# Altium project XH发衣柜从板.PrjPcb
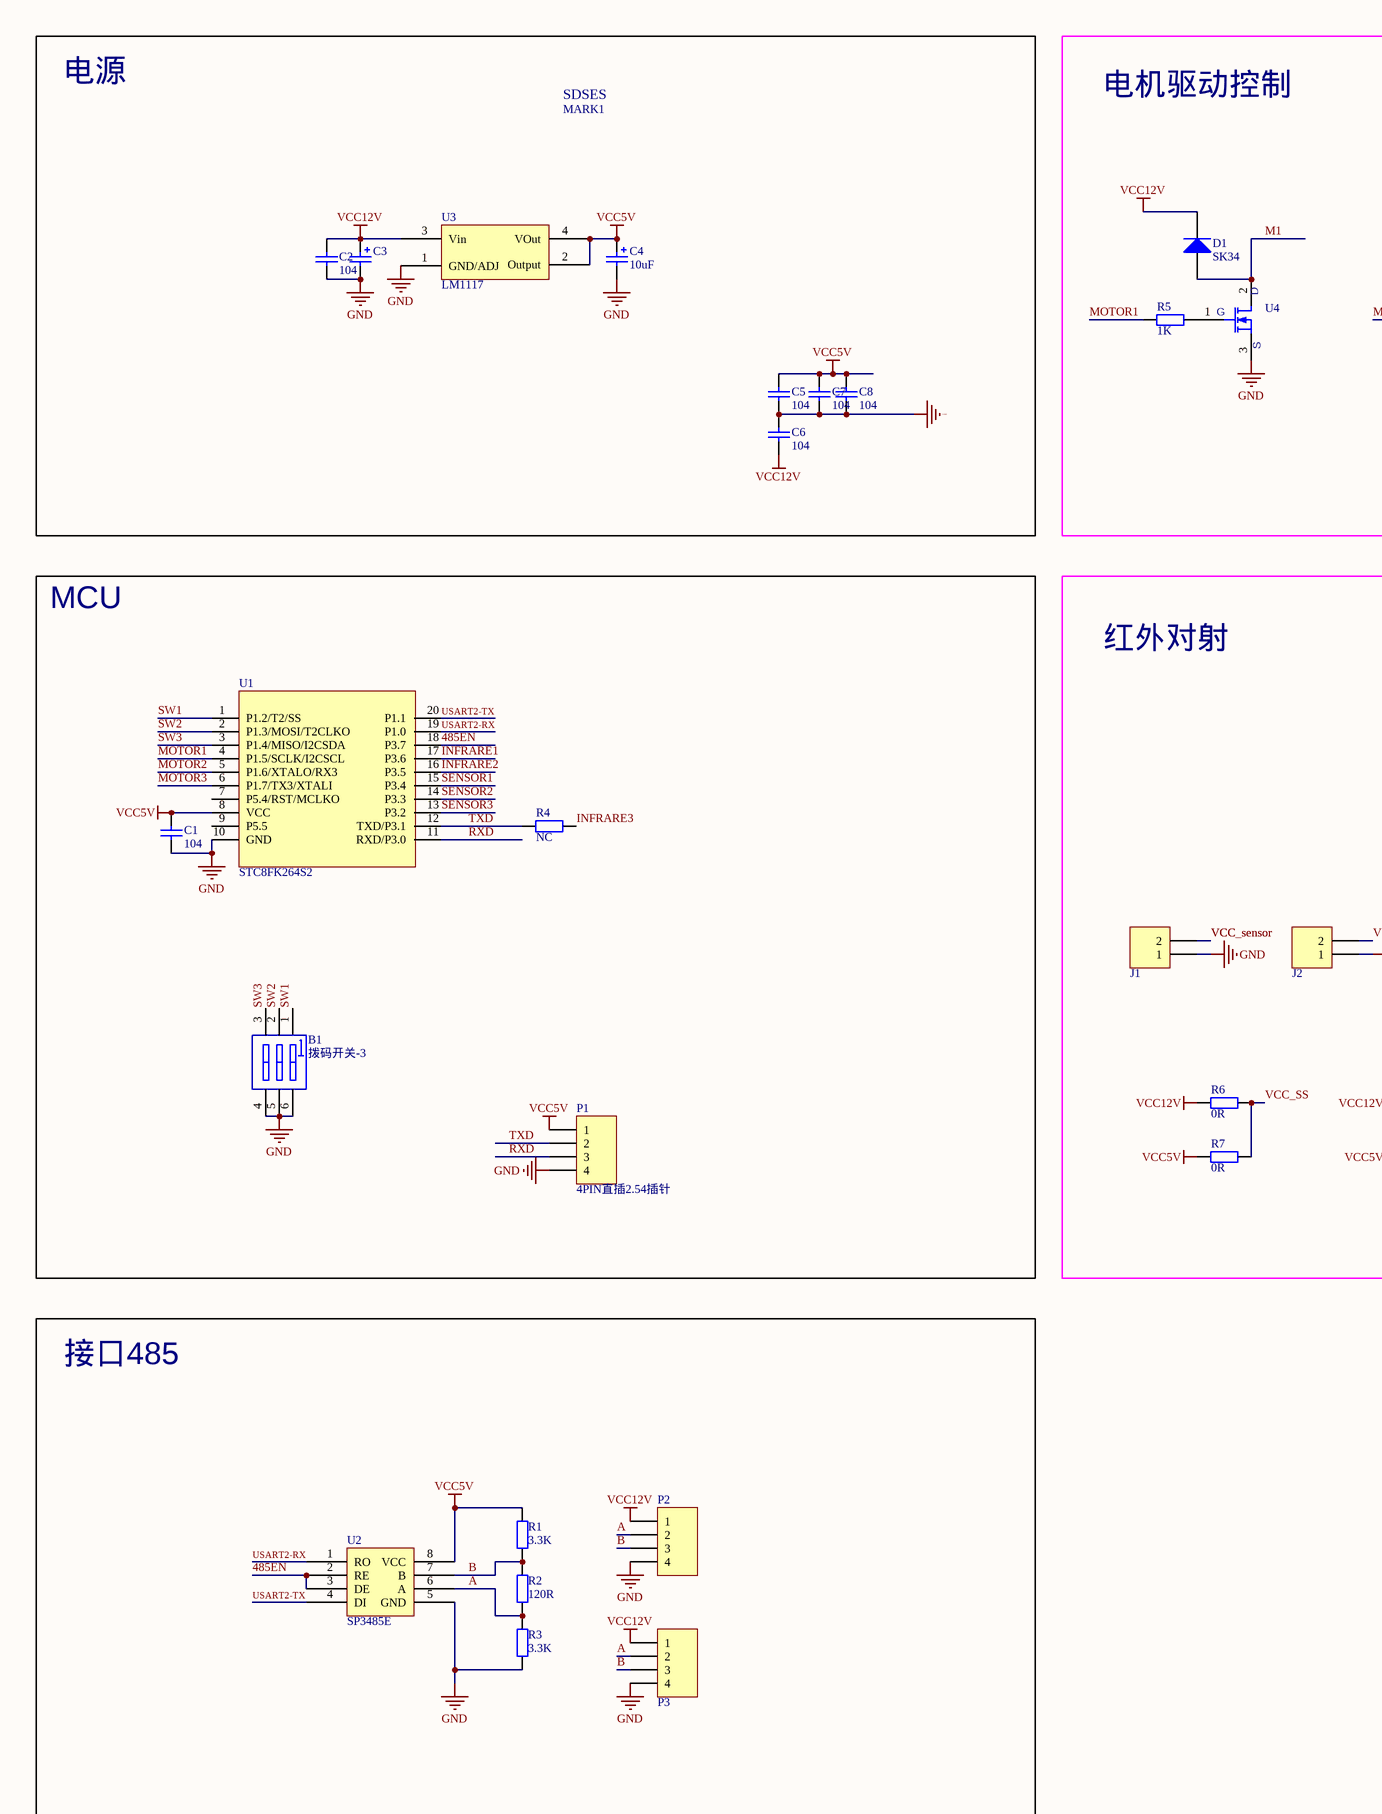
[diagram p0: MAIN.SchDoc, left]
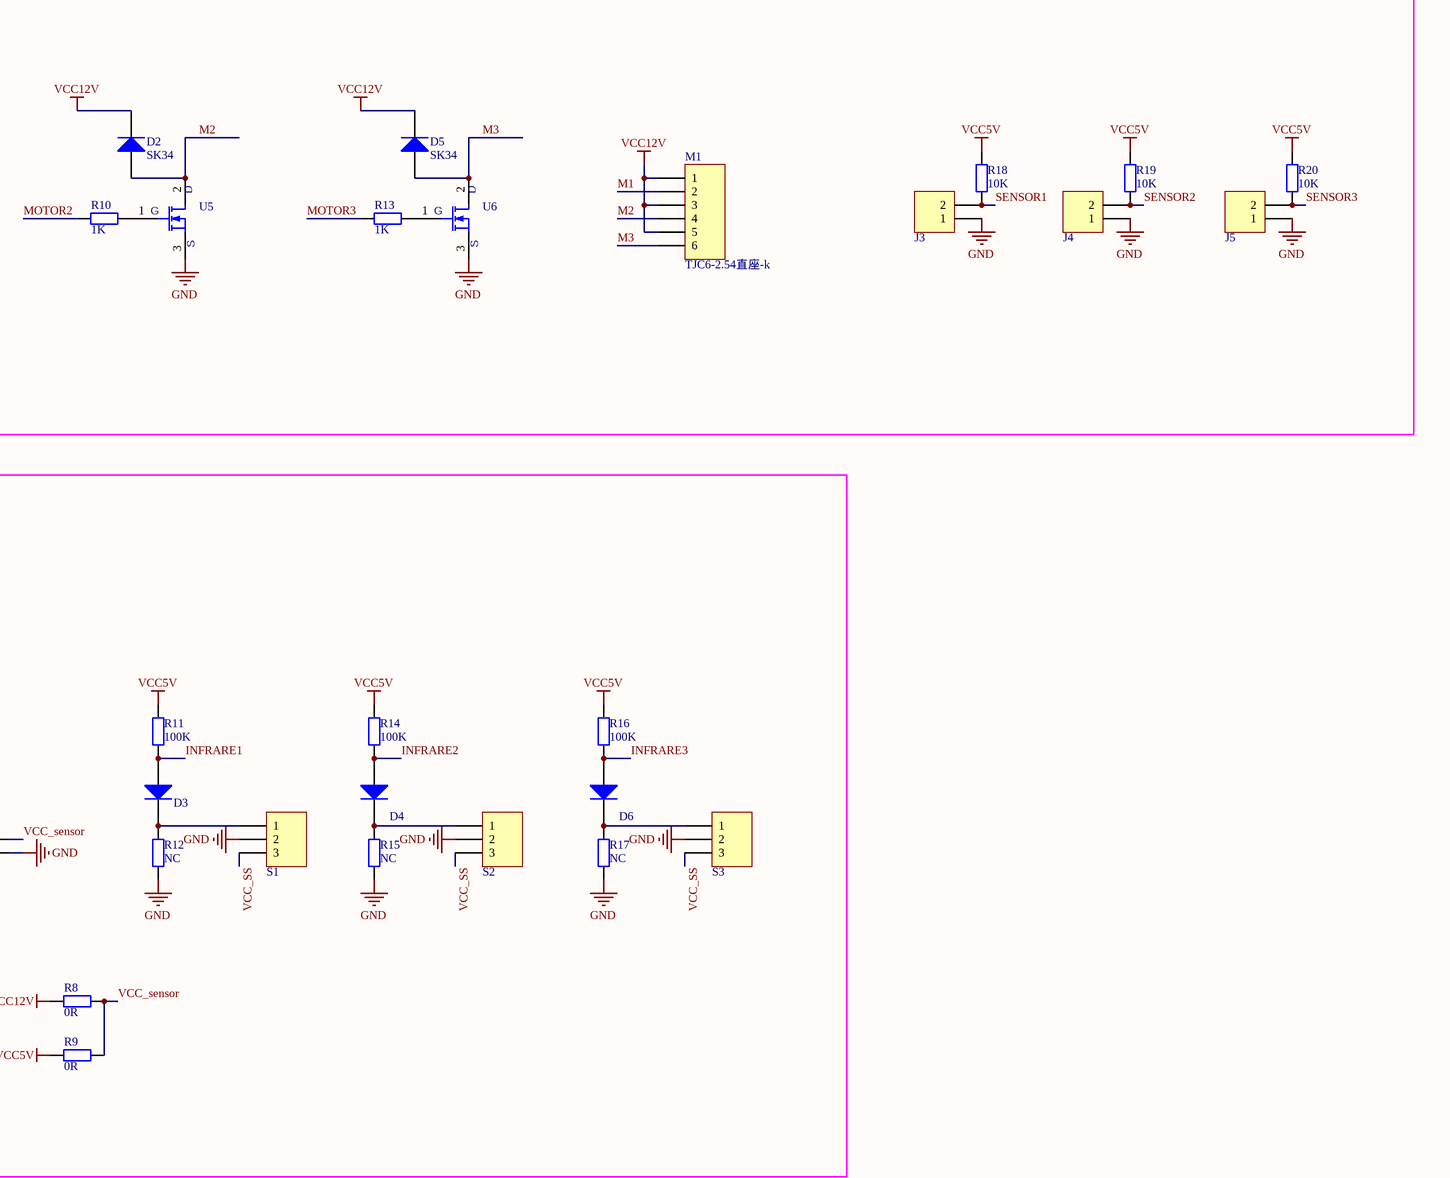
[diagram p1: MAIN.SchDoc, right]
1 sheet, 54 parts. Net scope: global (net labels, ports and power ports of the same name join across sheets).
Board file: XH发衣柜从板.PcbDoc

## Sheet MAIN.SchDoc
size A2

### Parts
B1  拨码开关-3  [DS-03-2.54]
C1  型号: 104  [0603C]  (hidden comment: Cap_0603)
C2  型号: 104  [0603C]  (hidden comment: Cap_0603)
C3  Cap_直插470uf/16v  [cap_470/16v]  (value not drawn)
C4  型号: 10uF  [0805C]  (hidden comment: Cap_钽电容B-3528)
C5  型号: 104  [0603C]  (hidden comment: Cap_0603)
C6  型号: 104  [0603C]  (hidden comment: Cap_0603)
C7  型号: 104  [0603C]  (hidden comment: Cap_0603)
C8  型号: 104  [0603C]  (hidden comment: Cap_0603)
D1  型号: SK34  [DO_214AC_SMA]  (hidden comment: Diode_DO214AC)
D2  型号: SK34  [DO_214AC_SMA]  (hidden comment: Diode_DO214AC)
D3  Diode_SOD323  [SOD323_D]  (value not drawn)
D4  Diode_SOD323  [SOD323_D]  (value not drawn)
D5  型号: SK34  [DO_214AC_SMA]  (hidden comment: Diode_DO214AC)
D6  Diode_SOD323  [SOD323_D]  (value not drawn)
J1  XHB2.54-2PIN-带锁扣  [SIP2]  (value not drawn)
J2  XHB2.54-2PIN-带锁扣  [SIP2]  (value not drawn)
J3  XHB2.54-2PIN-带锁扣  [SIP2]  (value not drawn)
J4  XHB2.54-2PIN-带锁扣  [SIP2]  (value not drawn)
J5  XHB2.54-2PIN-带锁扣  [SIP2]  (value not drawn)
M1  TJC6-2.54直座-k  [SIP6]
MARK1  SDSES  [SDSES]  (value not drawn)
P1  4PIN直插2.54插针  [SIP4_2D54F]
P2  XHB2.54-4PIN直座  [SIP4]  (value not drawn)
P3  XHB2.54-4PIN直座  [SIP4]  (value not drawn)
R1  型号: 3.3K  [0603R]  (hidden comment: Res_0603)
R2  型号: 120R  [0603R]  (hidden comment: Res_0603)
R3  型号: 3.3K  [0603R]  (hidden comment: Res_0603)
R4  型号: NC  [0603R]  (hidden comment: Res_0603)
R5  型号: 1K  [0603R]  (hidden comment: Res_0603)
R6  型号: 0R  [0603R]  (hidden comment: Res_0603)
R7  型号: 0R  [0603R]  (hidden comment: Res_0603)
R8  型号: 0R  [0603R]  (hidden comment: Res_0603)
R9  型号: 0R  [0603R]  (hidden comment: Res_0603)
R10  型号: 1K  [0603R]  (hidden comment: Res_0603)
R11  型号: 100K  [0603R]  (hidden comment: Res_0603)
R12  型号: NC  [0603R]  (hidden comment: Res_0603)
R13  型号: 1K  [0603R]  (hidden comment: Res_0603)
R14  型号: 100K  [0603R]  (hidden comment: Res_0603)
R15  型号: NC  [0603R]  (hidden comment: Res_0603)
R16  型号: 100K  [0603R]  (hidden comment: Res_0603)
R17  型号: NC  [0603R]  (hidden comment: Res_0603)
R18  型号: 10K  [0603R]  (hidden comment: Res_0603)
R19  型号: 10K  [0603R]  (hidden comment: Res_0603)
R20  型号: 10K  [0603R]  (hidden comment: Res_0603)
S1  TJC3-2.54直座  [SIP3]  (value not drawn)
S2  TJC3-2.54直座  [SIP3]  (value not drawn)
S3  TJC3-2.54直座  [SIP3]  (value not drawn)
U1  STC8FK264S2  [SSOP20]
U2  SP3485E  [SO_8]
U3  LM1117  [SOT223]
U4  NMOS  [TO-252-2]  (value not drawn)
U5  NMOS  [TO-252-2]  (value not drawn)
U6  NMOS  [TO-252-2]  (value not drawn)

### Blocks framed on the sheet
电源: C2-C8 MARK1 U3
电机驱动控制: D1 D2 D5 J3-J5 M1 R5 R10 R13 R18-R20 U4-U6
MCU: B1 C1 P1 R4 U1
红外对射: D3 D4 D6 J1 J2 R6-R9 R11 R12 R14-R17 S1-S3
接口485: P2 P3 R1-R3 U2

### Nets
GND: B1.4 B1.5 B1.6 C1.1 C2.1 C3.2 C4.2 C5.2 C6.2 C7.1 C8.1 J1.1 J2.1 J3.1 J4.1 J5.1 P1.4 P2.4 P3.4 R3.1 R12.1 R15.1 R17.1 S1.2 S2.2 S3.2 U1.10(GND) U2.5(GND) U3.1(GND/ADJ) U4.3(S) U5.3(S) U6.3(S)
VCC5V: C1.2 C4.1 C5.1 C7.2 C8.2 P1.1 R1.2 R7.2 R9.2 R11.2 R14.2 R16.2 R18.1 R19.1 R20.1 U1.8(VCC) U2.8(VCC) U3.2(Output) U3.4(VOut)
VCC12V: C2.2 C3.1 C6.1 D1.2 D2.2 D5.2 M1.1 M1.3 M1.5 P2.1 P3.1 R6.2 R8.2 U3.3(Vin)
485EN: U1.18(P3.7) U2.2(RE) U2.3(DE)
A: P2.2 P3.2 R2.1 R3.2 U2.6(A)
B: P2.3 P3.3 R1.1 R2.2 U2.7(B)
INFRARE1: D3.1 R11.1 U1.17(P3.6)
INFRARE2: D4.1 R14.1 U1.16(P3.5)
INFRARE3: D6.1 R4.1 R16.1
M1: D1.1 M1.2 U4.2(D)
M2: D2.1 M1.4 U5.2(D)
M3: D5.1 M1.6 U6.2(D)
MOTOR1: R5.1 U1.4(P1.5/SCLK/I2CSCL)
MOTOR2: R10.1 U1.5(P1.6/XTALO/RX3)
MOTOR3: R13.1 U1.6(P1.7/TX3/XTALI)
RXD: P1.3 U1.11(RXD/P3.0)
SENSOR1: J3.2 R18.2 U1.15(P3.4)
SENSOR2: J4.2 R19.2 U1.14(P3.3)
SENSOR3: J5.2 R20.2 U1.13(P3.2)
SW1: B1.1(A1) U1.1(P1.2/T2/SS)
SW2: B1.2 U1.2(P1.3/MOSI/T2CLKO)
SW3: B1.3 U1.3(P1.4/MISO/I2CSDA)
TXD: P1.2 R4.2 U1.12(TXD/P3.1)
USART2-RX: U1.19(P1.0) U2.1(RO)
USART2-TX: U1.20(P1.1) U2.4(DI)
VCC_sensor: J1.2 J2.2 R8.1 R9.1
VCC_SS: R6.1 R7.1 S1.3 S2.3 S3.3
NetD3_2: D3.2 R12.2 S1.1
NetD4_2: D4.2 R15.2 S2.1
NetD6_2: D6.2 R17.2 S3.1
NetR5_2: R5.2 U4.1(G)
NetR10_2: R10.2 U5.1(G)
NetR13_2: R13.2 U6.1(G)

Not connected (* = marked no-connect by the designer): U1 7(P5.4/RST/MCLKO) 9(P5.5)

### Library data of the parts
B1 = 拨码开关-3: 名称: 插接件; 型号: 拨码开关DSWB03LHGET; 参考网址: C99420; 容差: *
C1 C2 C5-C8 = Cap_0603: 名称: 贴片电容; 容差: 20%; 参考网址: NA
C3 = Cap_直插470uf/16v: Polarized Capacitor (Radial); 名称: 贴片电容; 容差: 20%; 型号: 470UF/16V电容; 参考网址: *
C4 = Cap_钽电容B-3528: Polarized Capacitor (Radial); 名称: 贴片电容; 容差: ≤20%; 参考网址: *
D1 D2 D5 = Diode_DO214AC: Default Diode; 名称: 贴片二极管; 容差: NA; 参考网址: *
D3 D4 D6 = Diode_SOD323: Default Diode; Published: 8-Jun-2000; LatestRevisionDate: 17-Jul-2002; LatestRevisionNote: Re-released for DXP Platform.; PackageVersion: Sep-1996; PackageReference: SMC; Publisher: Altium Limited; PackageDescription: DO-214-AB/SMC; 2 C-Bend Leads; Body 7.9 x 5.9 mm, inc. leads (LxW); Code_JEDEC: DO-214-AB
J1-J5 = XHB2.54-2P直座: Header, 4-Pin; 名称: 插接件; 容差: *; 参考网址: *; 型号: XHB2.54-2PIN-带锁扣
M1 = TJC6-2.54直座-k: Header, 6-Pin; 名称: 插接件; 型号: XHB2.54-6PIN-直插锁扣座; 容差: https://item.taobao.com/item.htm?spm=a230r.1.14.16.ebb2eb2XgBFau&id=536742831564&ns=1&abbucket=6#detail; 参考网址: *
P1 = 4PIN直插2.54插针: Header, 4-Pin; 名称: 插接件; 容差: NA; 型号: 4PIN直插2.54插针; 参考网址: *
P2 P3 = XHB2.54-4PIN直座: Header, 4-Pin; 名称: 插接件; 型号: XHB2.54-4PIN直座; 容差: https://item.taobao.com/item.htm?spm=a230r.1.14.16.ebb2eb2XgBFau&id=536742831564&ns=1&abbucket=6#detail; 参考网址: *
R1-R20 = Res_0603: Resistor; 名称: 贴片电阻; 容差: 5%; 参考网址: *
S1-S3 = TJC3-2.54直座: Header, 3-Pin; 名称: 插接件; 型号: PH2.0-3PIN-直座; 容差: *; 参考网址: *
U1 = STC8FK264S2: 名称: 集成芯片; 容差: *; 参考网址: *; 型号: STC8FK264S2
U2 = SP485E
U3 = LM1117: 名称: 集成芯片; 型号: AMS1117/LM1117-3.3V; 容差: NA; 参考网址: C108494/C71121/C94058
U4-U6 = NMOS: 名称: 集成芯片; 型号: AOD484; 容差: NA; 参考网址: *